# EAGLE design mini-v1.11-macrofab (EAGLE 7.2.0)

## Sheet 1 of 4: Main Microcontroller
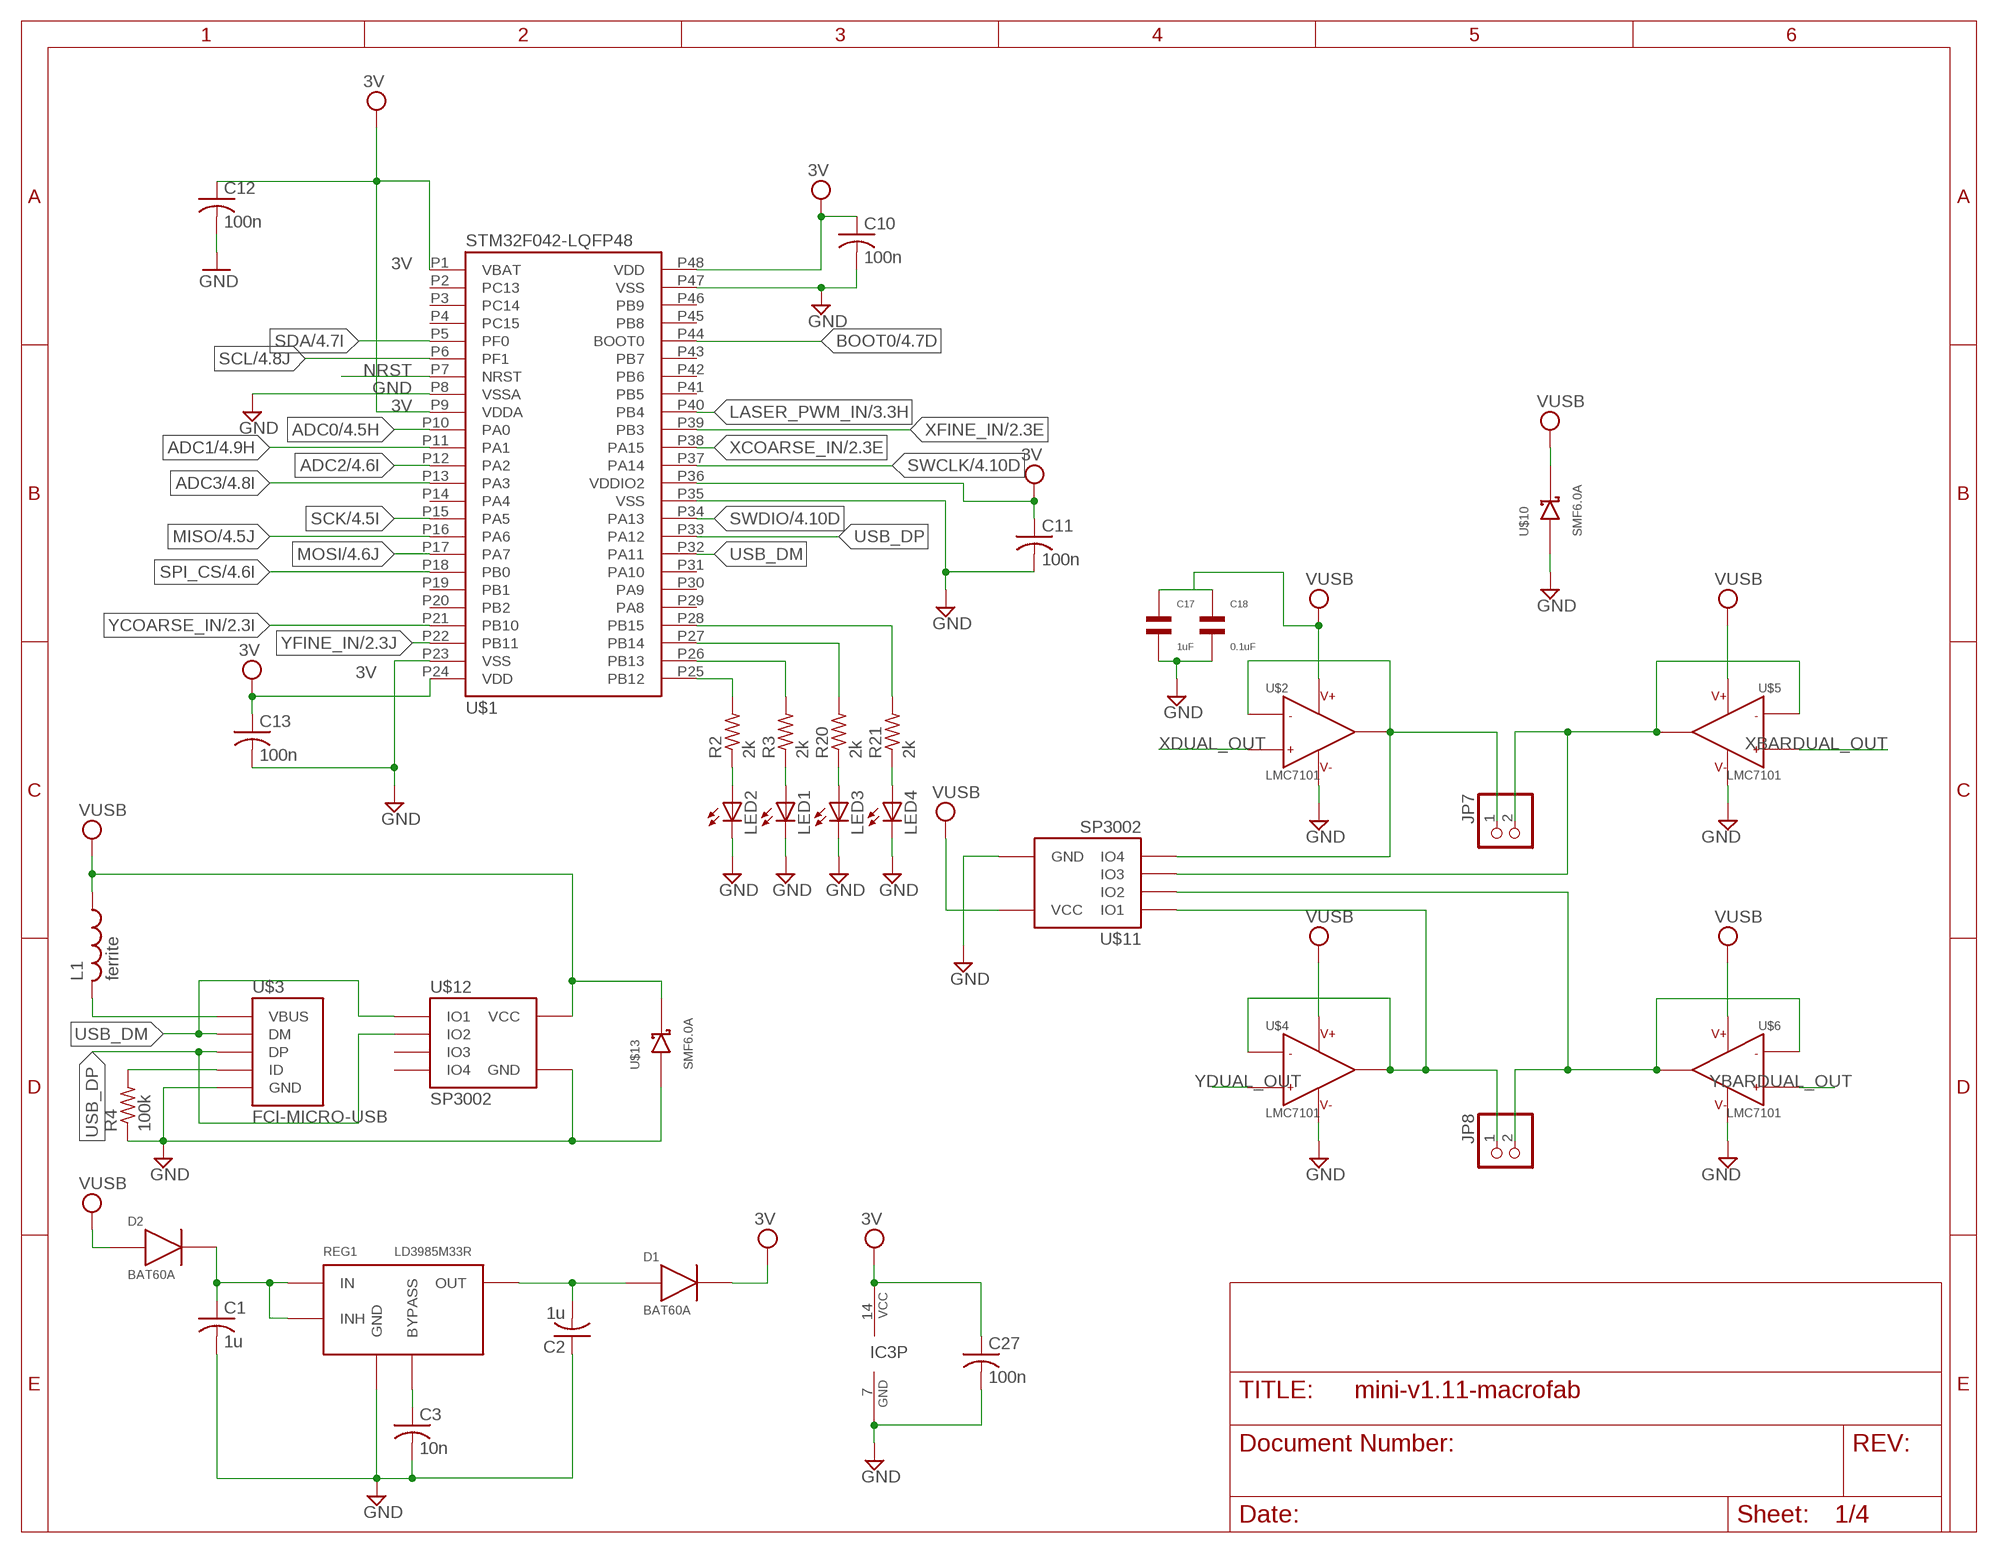
[diagram p0: schematic, sheet 1]

### Parts
C1  1u  C-USC0603  [C0603]
C2  1u  C-USC0603  [C0603]
C3  10n  C-USC0603  [C0603]
C10  100n  C-USC0603  [C0603]
C11  100n  C-USC0603  [C0603]
C12  100n  C-USC0603  [C0603]
C13  100n  C-USC0603  [C0603]
C17  1uF  CAPACITOR_NP_0603  [C0603]
C18  0.1uF  CAPACITOR_NP_0603  [C0603]
C27  100n  C-USC0603  [C0603]
D1  BAT60A  [SOD323]
D2  BAT60A  [SOD323]
IC3  74S04D  [SO14]
JP7  PINHD-1X2  [1X02]
JP8  PINHD-1X2  [1X02]
L1  ferrite  L-US  [C0603]
LED1  LEDCHIP-LED0603  [CHIP-LED0603]
LED2  LEDCHIP-LED0603  [CHIP-LED0603]
LED3  LEDCHIP-LED0603  [CHIP-LED0603]
LED4  LEDCHIP-LED0603  [CHIP-LED0603]
R2  2k  R-US_R0603  [R0603]
R3  2k  R-US_R0603  [R0603]
R4  100k  R-US_R0603  [R0603]
R20  2k  R-US_R0603  [R0603]
R21  2k  R-US_R0603  [R0603]
REG1  LD3985M33R  LD3985MXXR  [SOT23-5L]
U$1  STM32F042-LQFP48  [LQFP48]
U$2  LMC7101  [SOT23-5]
U$3  FCI-MICRO-USB  [FCI-MICROUSB]
U$4  LMC7101  [SOT23-5]
U$5  LMC7101  [SOT23-5]
U$6  LMC7101  [SOT23-5]
U$10  SMF6.0A  MBR0520  [SOD123]
U$11  SP3002  [SC70-6]
U$12  SP3002  [SC70-6]
U$13  SMF6.0A  MBR0520  [SOD123]

### Nets
3V: C10.1 C11.1 C12.1 C13.1 C27.1 D1.1 IC3.14(P:VCC) U$1.P1(VBAT) U$1.P9(VDDA) U$1.P24(VDD) U$1.P36(VDDIO2) U$1.P48(VDD) ; also sheet 2,4
3V3: C2.2 D1.2 REG1.OUT
ADC0: U$1.P10(PA0) ; also sheet 4
ADC1: U$1.P11(PA1) ; also sheet 4
ADC2: U$1.P12(PA2) ; also sheet 4
ADC3: U$1.P13(PA3) ; also sheet 4
BOOT0: U$1.P44(BOOT0) ; also sheet 4
GND [Power]: C1.2 C2.1 C3.2 C10.2 C11.2 C12.2 C13.2 C17.P$2 C18.P$2 C27.2 IC3.7(P:GND) LED1.C LED2.C LED3.C LED4.C R4.1 REG1.GND U$1.P8(VSSA) U$1.P23(VSS) U$1.P35(VSS) U$1.P47(VSS) U$2.5 U$3.P5(GND) U$4.5 U$5.5 U$6.5 U$10.ANODE U$11.P2(GND) U$12.P2(GND) U$13.ANODE ; also sheet 2,3,4
LASER_PWM_IN: U$1.P40(PB4) ; also sheet 3
MISO: U$1.P16(PA6) ; also sheet 4
MOSI: U$1.P17(PA7) ; also sheet 4
N$1: C3.1 REG1.BYPASS
N$2: R2.2 U$1.P25(PB12)
N$3: LED2.A R2.1
N$4: C1.1 D2.1 REG1.IN REG1.INHIBIT(INH)
N$5: R4.2 U$3.P4(ID)
N$7: JP7.1 U$2.1 U$2.4 U$11.P6(IO4)
N$9: JP8.1 U$4.1 U$4.4 U$11.P1(IO1)
N$12: LED1.A R3.1
N$13: R3.2 U$1.P26(PB13)
N$14: L1.2 U$3.P1(VBUS)
N$16: JP7.2 U$5.1 U$5.4 U$11.P4(IO3)
N$17: JP8.2 U$6.1 U$6.4 U$11.P3(IO2)
N$24: LED3.A R20.1
N$27: LED4.A R21.1
N$28: R20.2 U$1.P27(PB14)
N$29: R21.2 U$1.P28(PB15)
NRST: U$1.P7(NRST) ; also sheet 4
SCK: U$1.P15(PA5) ; also sheet 4
SCL: U$1.P6(PF1) ; also sheet 4
SDA: U$1.P5(PF0) ; also sheet 4
SPI_CS: U$1.P18(PB0) ; also sheet 4
SWCLK: U$1.P37(PA14) ; also sheet 4
SWDIO: U$1.P34(PA13) ; also sheet 4
USB_DM: U$1.P32(PA11) U$3.P2(DM) U$12.P1(IO1)
USB_DP: U$1.P33(PA12) U$3.P3(DP) U$12.P3(IO2)
VUSB [Power]: C17.P$1 C18.P$1 D2.2 L1.1 U$2.2 U$4.2 U$5.2 U$6.2 U$10.CATHODE U$11.P5(VCC) U$12.P5(VCC) U$13.CATHODE ; also sheet 2,3,4
XBARDUAL_OUT: U$5.3 ; also sheet 2
XCOARSE_IN: U$1.P38(PA15) ; also sheet 2
XDUAL_OUT: U$2.3 ; also sheet 2
XFINE_IN: U$1.P39(PB3) ; also sheet 2
YBARDUAL_OUT: U$6.3 ; also sheet 2
YCOARSE_IN: U$1.P21(PB10) ; also sheet 2
YDUAL_OUT: U$4.3 ; also sheet 2
YFINE_IN: U$1.P22(PB11) ; also sheet 2
Unconnected: U$1.P2(PC13) U$1.P3(PC14) U$1.P4(PC15) U$1.P14(PA4) U$1.P19(PB1) U$1.P20(PB2) U$1.P29(PA8) U$1.P30(PA9) U$1.P31(PA10) U$1.P41(PB5) U$1.P42(PB6) U$1.P43(PB7) U$1.P45(PB8) U$1.P46(PB9) U$12.P4(IO3) U$12.P6(IO4)

## Sheet 2 of 4: Dual PWM
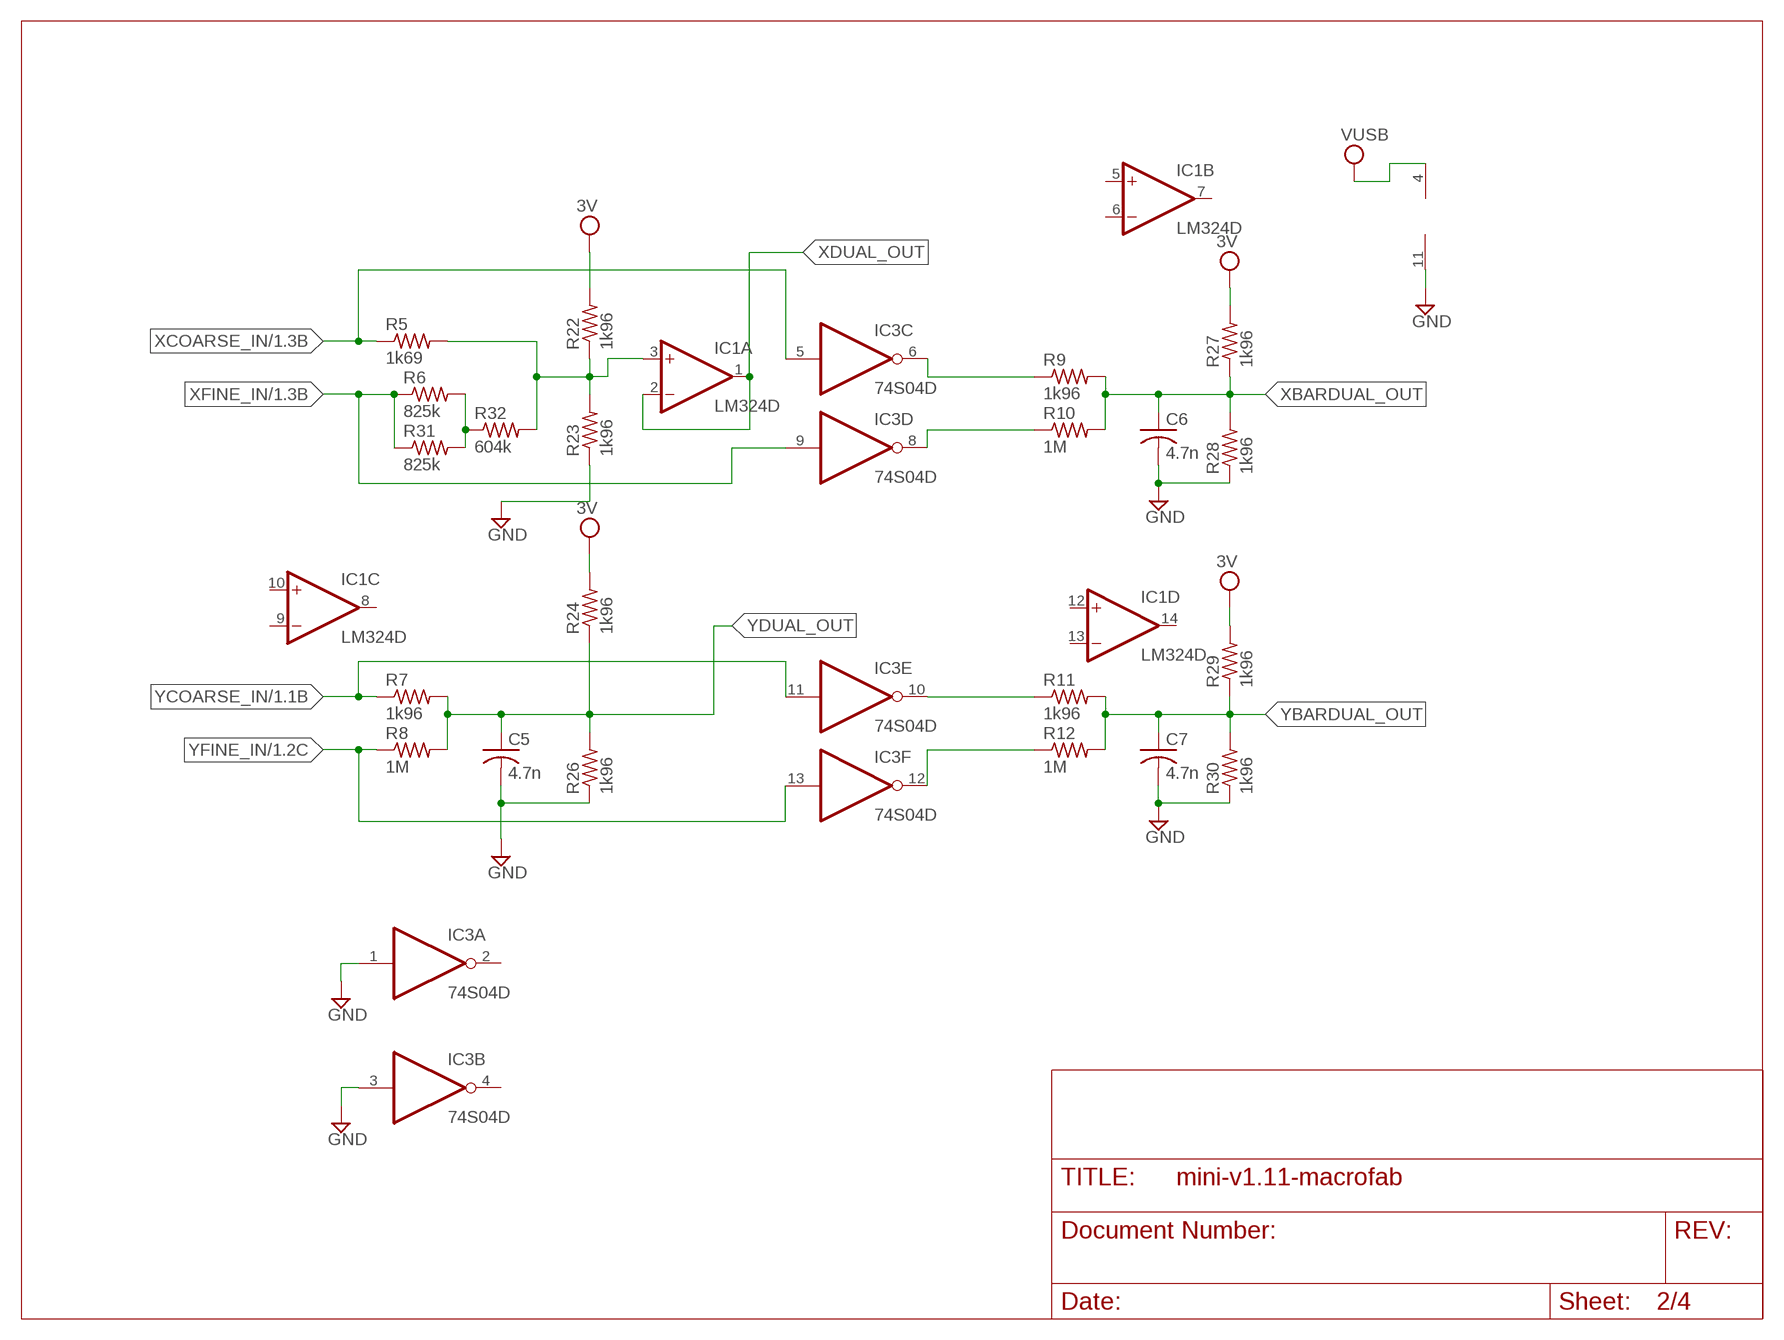
[diagram p1: schematic, sheet 2]

### Parts
C5  4.7n  C-USC0603  [C0603]
C6  4.7n  C-USC0603  [C0603]
C7  4.7n  C-USC0603  [C0603]
IC1  LM324D  [SO14]
R5  1k69  R-US_R0603  [R0603]
R6  825k  R-US_R0603  [R0603]
R7  1k96  R-US_R0603  [R0603]
R8  1M  R-US_R0603  [R0603]
R9  1k96  R-US_R0603  [R0603]
R10  1M  R-US_R0603  [R0603]
R11  1k96  R-US_R0603  [R0603]
R12  1M  R-US_R0603  [R0603]
R22  1k96  R-US_R0603  [R0603]
R23  1k96  R-US_R0603  [R0603]
R24  1k96  R-US_R0603  [R0603]
R26  1k96  R-US_R0603  [R0603]
R27  1k96  R-US_R0603  [R0603]
R28  1k96  R-US_R0603  [R0603]
R29  1k96  R-US_R0603  [R0603]
R30  1k96  R-US_R0603  [R0603]
R31  825k  R-US_R0603  [R0603]
R32  604k  R-US_R0603  [R0603]

### Nets
3V: R22.2 R24.2 R27.2 R29.2 ; also sheet 1,4
GND [Power]: C5.2 C6.2 C7.2 IC1.11(P:V-) IC3.1(A:I) IC3.3(B:I) R23.1 R26.1 R28.1 R30.1 ; also sheet 1,3,4
N$6: IC3.10(E:O) R11.1
N$8: IC3.12(F:O) R12.1
N$10: IC3.8(D:O) R10.1
N$11: IC3.6(C:O) R9.1
N$31: R6.2 R31.2 R32.1
N$33: IC1.3(A:+IN) R5.2 R22.1 R23.2 R32.2
VUSB [Power]: IC1.4(P:V+) ; also sheet 1,3,4
XBARDUAL_OUT: C6.1 R9.2 R10.2 R27.1 R28.2 ; also sheet 1
XCOARSE_IN: IC3.5(C:I) R5.1 ; also sheet 1
XDUAL_OUT: IC1.1(A:OUT) IC1.2(A:-IN) ; also sheet 1
XFINE_IN: IC3.9(D:I) R6.1 R31.1 ; also sheet 1
YBARDUAL_OUT: C7.1 R11.2 R12.2 R29.1 R30.2 ; also sheet 1
YCOARSE_IN: IC3.11(E:I) R7.1 ; also sheet 1
YDUAL_OUT: C5.1 R7.2 R8.2 R24.1 R26.2 ; also sheet 1
YFINE_IN: IC3.13(F:I) R8.1 ; also sheet 1
Unconnected: IC1.5(B:+IN) IC1.6(B:-IN) IC1.7(B:OUT) IC1.8(C:OUT) IC1.9(C:-IN) IC1.10(C:+IN) IC1.12(D:+IN) IC1.13(D:-IN) IC1.14(D:OUT) IC3.2(A:O) IC3.4(B:O)

## Sheet 3 of 4: Laser Power Driver
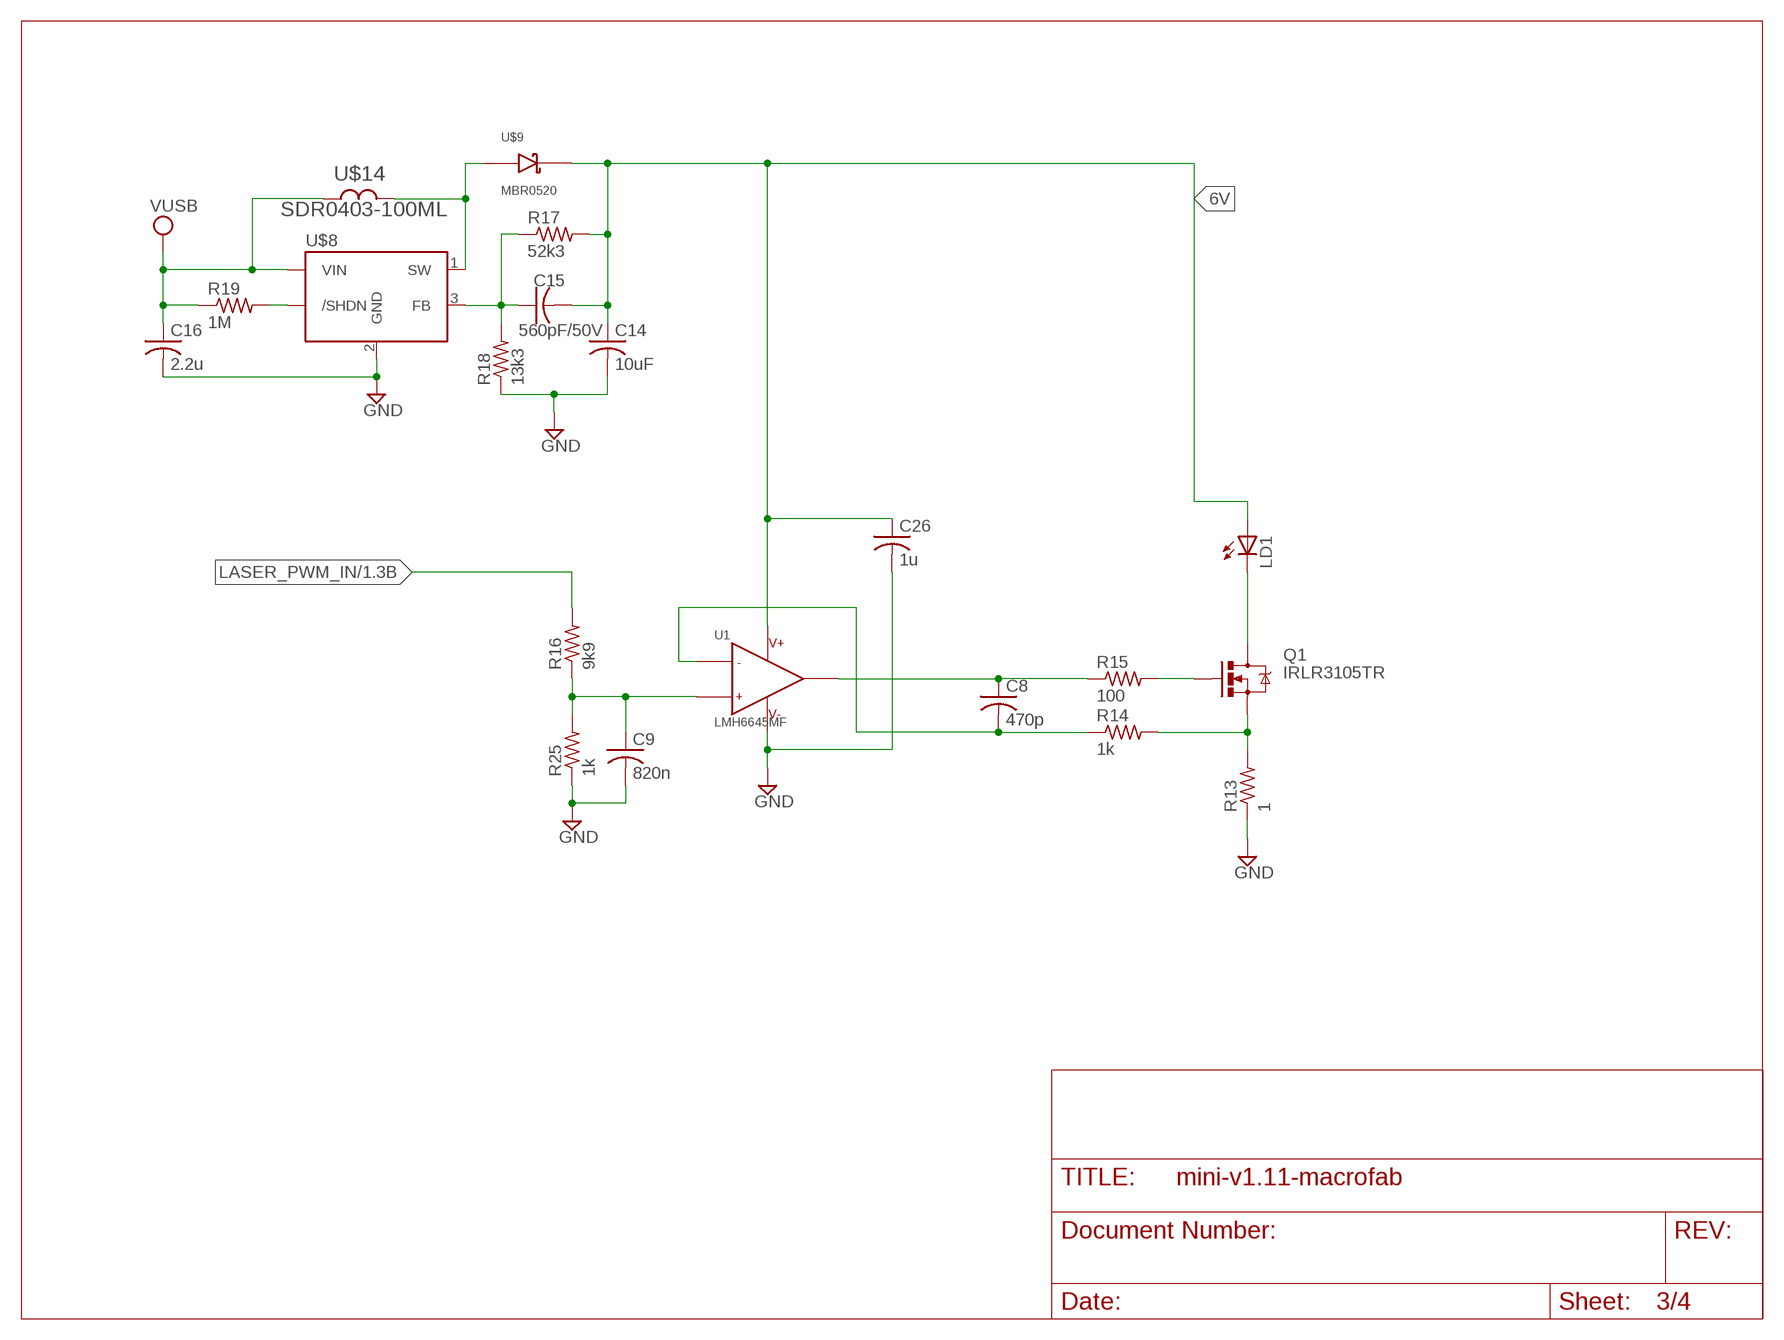
[diagram p2: schematic, sheet 3]

### Parts
C8  470p  C-USC0603  [C0603]
C9  820n  C-USC0603  [C0603]
C14  10uF  C-USC0603  [C0603]
C15  560pF/50V  C-USC0603  [C0603]
C16  2.2u  C-USC0603  [C0603]
C26  1u  C-USC0603  [C0603]
LD1  LASERDIODELD2  [LASERDIODE2]
Q1  IRLR3105TR  FET-N-IRLR3105TRIRLR3105TR  [DPAK]
R13  1  R-US_R0603  [R0603]
R14  1k  R-US_R0603  [R0603]
R15  100  R-US_R0603  [R0603]
R16  9k9  R-US_R0603  [R0603]
R17  52k3  R-US_R0603  [R0603]
R18  13k3  R-US_R0603  [R0603]
R19  1M  R-US_R0603  [R0603]
R25  1k  R-US_R0603  [R0603]
U1  LMH6645MF  OPAMP-SINGLELMH6645MF  [SOT23-5]
U$8  LMR62014  [SOT23-5]
U$9  MBR0520  [SOD123]
U$14  SDR0403-100ML  SDR0403  [SDR0403]

### Nets
6V [Power]: C14.1 C15.2 C26.1 LD1.P$1(A) R17.2 U1.5(V+) U$9.CATHODE
GND [Power]: C9.2 C14.2 C16.2 C26.2 R13.1 R18.1 R25.1 U1.2(V-) U$8.2(GND) ; also sheet 1,2,4
LASER_PWM_IN: R16.2 ; also sheet 1
N$15: U$8.1(SW) U$9.ANODE U$14.P$2
N$18: LD1.P$3(C) Q1.4(D)
N$19: Q1.3(S) R13.2 R14.2
N$20: C8.2 R14.1 U1.4(IN-)
N$21: Q1.1(G) R15.2
N$22: C8.1 R15.1 U1.1(OUT)
N$23: C9.1 R16.1 R25.2 U1.3(IN+)
N$25: C15.1 R17.1 R18.2 U$8.3(FB)
N$26: R19.2 U$8.4(/SHDN)
VUSB [Power]: C16.1 R19.1 U$8.5(VIN) U$14.P$1 ; also sheet 1,2,4

## Sheet 4 of 4
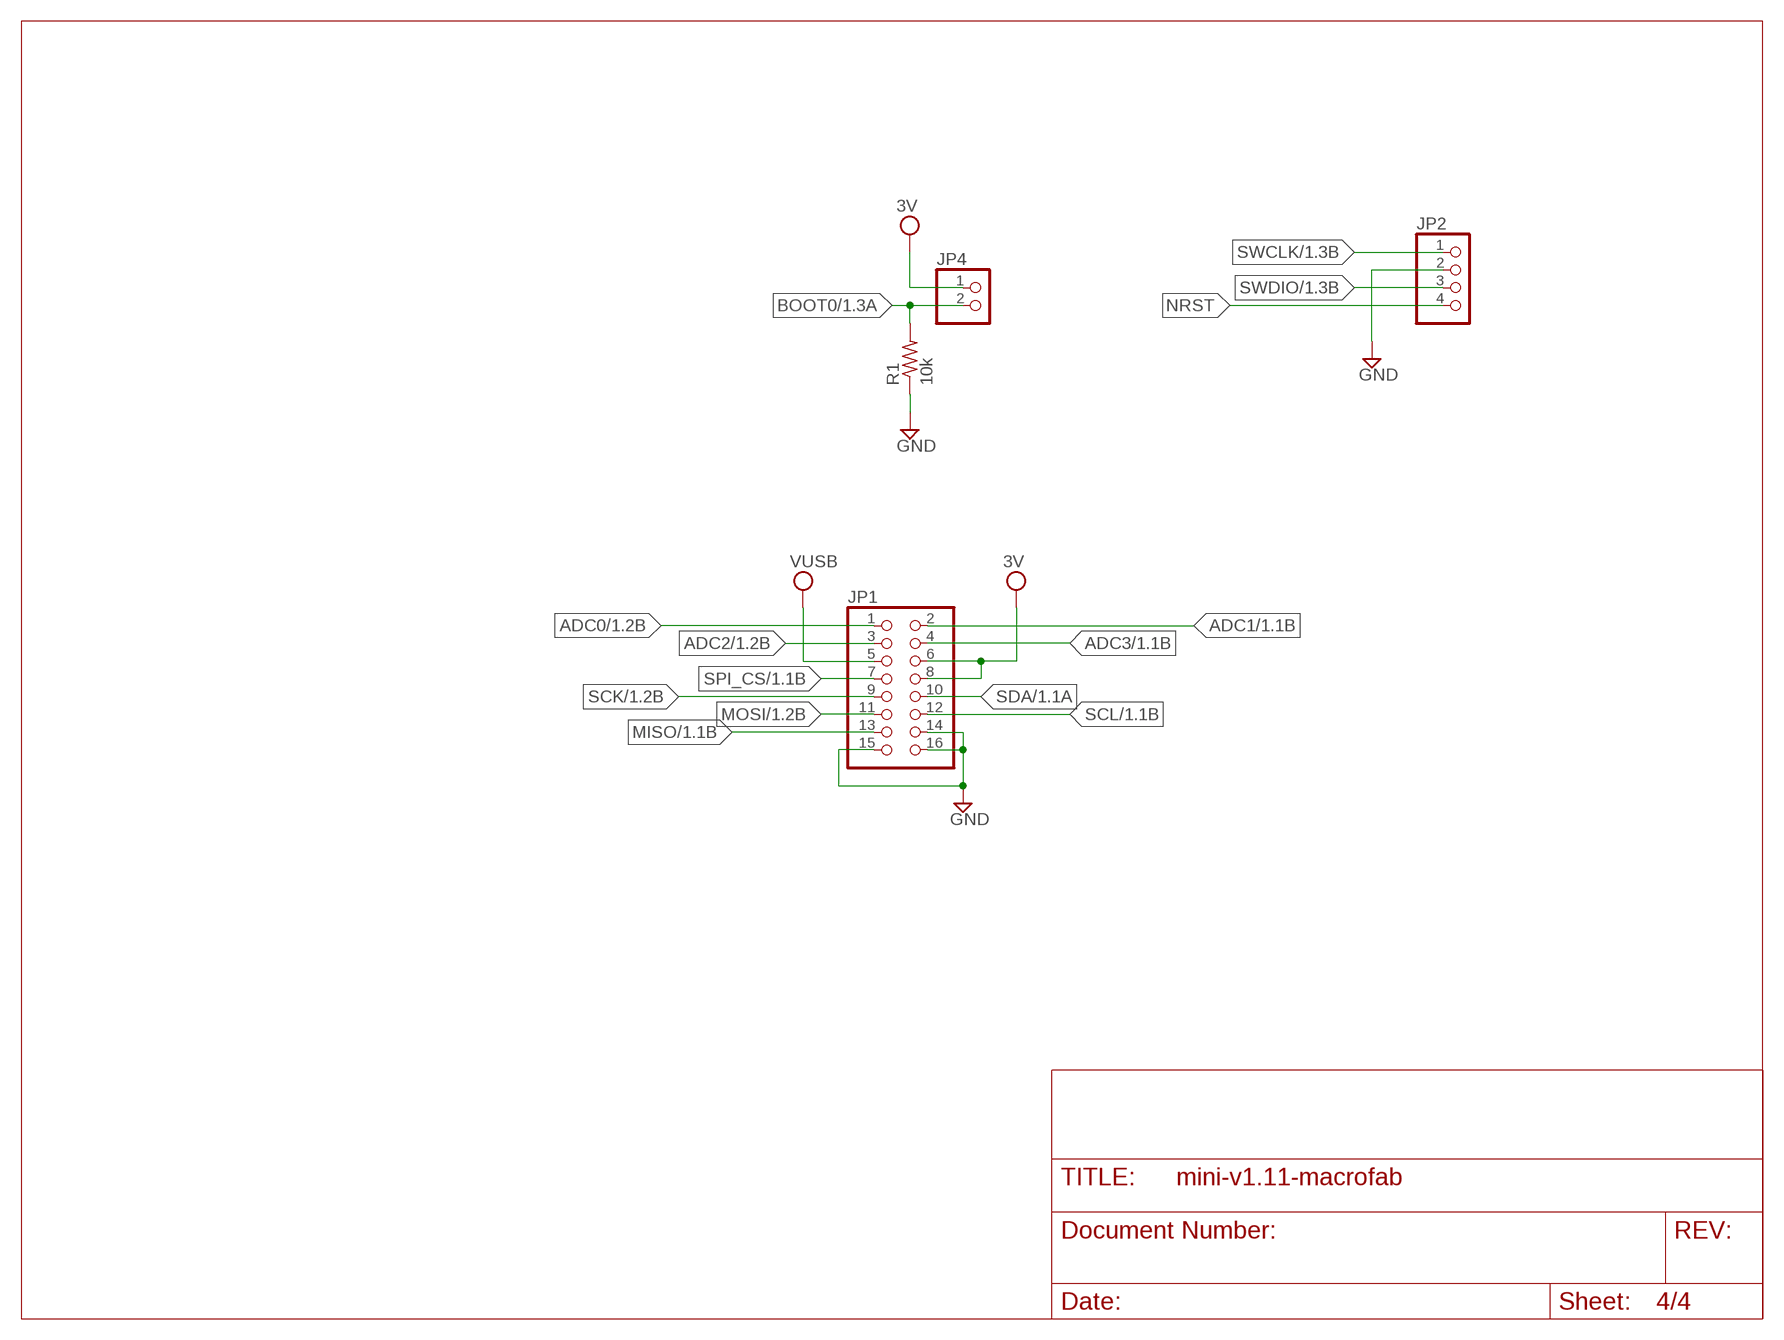
[diagram p3: schematic, sheet 4]

### Parts
JP1  PINHD-2X8  [2X08]
JP2  PINHD-1X4  [1X04]
JP4  PINHD-1X2  [1X02]
R1  10k  R-US_R0603  [R0603]

### Nets
3V: JP1.6 JP1.8 JP4.1 ; also sheet 1,2
ADC0: JP1.1 ; also sheet 1
ADC1: JP1.2 ; also sheet 1
ADC2: JP1.3 ; also sheet 1
ADC3: JP1.4 ; also sheet 1
BOOT0: JP4.2 R1.2 ; also sheet 1
GND [Power]: JP1.14 JP1.15 JP1.16 JP2.2 R1.1 ; also sheet 1,2,3
MISO: JP1.13 ; also sheet 1
MOSI: JP1.11 ; also sheet 1
NRST: JP2.4 ; also sheet 1
SCK: JP1.9 ; also sheet 1
SCL: JP1.12 ; also sheet 1
SDA: JP1.10 ; also sheet 1
SPI_CS: JP1.7 ; also sheet 1
SWCLK: JP2.1 ; also sheet 1
SWDIO: JP2.3 ; also sheet 1
VUSB [Power]: JP1.5 ; also sheet 1,2,3

## Library data of the parts
C1-C3 C5-C16 C26 C27 = rcl:C-US: CAPACITOR, American symbol
C17 C18 = MF_Passives:CAPACITOR_NP: Library: MF_Passives Description: Device for Non-Polarized Capacitors. Manufacture part number (MFG#), Voltage, Temperature Coefficient, and Tolerance can be added via Attributes.; MFG#: N/A; TEMP_COF: N/A; TOLERANCE: N/A; VOLTAGE: N/A
D1 D2 = lmdparts:BAT60A
IC1 = linear:LM324: OP AMP
IC3 = lmdparts:74*04: Hex INVERTER
JP1 = pinhead:PINHD-2X8: PIN HEADER
JP2 = pinhead:PINHD-1X4: PIN HEADER
JP4 JP7 JP8 = pinhead:PINHD-1X2: PIN HEADER
L1 = lmdparts:L-US: INDUCTOR, American symbol
LD1 = Scott:LASERDIODE; MPN: 3 x (0552-2-15-15-11-27-10-0)
LED1-LED4 = adafruit:LED: LED OSRAM: - CHIPLED LG R971, LG N971, LY N971, LG Q971, LY Q971, LO R971, LY R971 LH N974, LH R974 LS Q976, LO Q976, LY Q976 LO Q996 - Hyper CHIPLED LW Q18S LB Q993, LB Q99A, LB R99A - SideLED LS A670, LO A670, LY A670, LG A670, LP A670 LB A673, LV A673, LT A673, LW A673 LH A674 LY A675 LS A676, LA A676, LO A676, LY A676, LW A676 LS A679, LY A679, LG A679 - Hyper Micro SIDELED® LS Y876, LA Y876, LO Y876, LY Y876 LT Y87S - SmartLED LW L88C, LW L88S LB L89C, LB L89S, LG L890 LS L89K, LO L89K, LY L89K LS L896, LA L896, LO L896, LY L896 - TOPLED LS T670, LO T670, LY T670, LG T670, LP T670 LSG T670, LSP T670, LSY T670, LOP T670, LYG T670 LG T671, LOG T671, LSG T671 LB T673, LV T673, LT T673, LW T673 LH T674 LS T676, LA T676, LO T676, LY T676, LB T676, LH T676, LSB T676, LW T676 LB T67C, LV T67C, LT T67C, LS T67K, LO T67K, LY T67K, LW E67C LS E67B, LA E67B, LO E67B, LY E67B, LB E67C, LV E67C, LT E67C LW T67C LS T679, LY T679, LG T679 LS T770, LO T770, LY T770, LG T770, LP T770 LB T773, LV T773, LT T773, LW T773 LH T774 LS E675, LA E675, LY E675, LS T675 LS T776, LA T776, LO T776, LY T776, LB T776 LHGB T686 LT T68C, LB T68C - Hyper Mini TOPLED® LB M676 - Mini TOPLED Santana® LG M470 LS M47K, LO M47K, LY M47K Source: http://www.osram.convergy.de/
Q1 = lmdparts:FET-N-IRLR3105TR: Common NMOSFET Parts MFG P/N Store ID Prod ID FDD8780 TRANS-09984 SI7820DN TRANS-11055 FDS6630A IC-08089 2N7002PW TRANS-11151 FQP30N06L COM-10213 TRANS-10060 BSS123LT1G TRANS-08345 BSS138 TRANS-00830 BS170 2N7000; PROD_ID: TRANS-09984
R1-R32 = rcl:R-US_: RESISTOR, American symbol
REG1 = lmdparts:LD3985MXXR
U1 = lmdparts:OPAMP-SINGLE: Single amp opamps
U$1 = lmdparts:STM32F042-LQFP48
U$2 U$4-U$6 = lmdparts:LMC7101
U$3 = lmdparts:FCI-MICRO-USB
U$8 = lmdparts:LMR62014
U$9 U$10 U$13 = lmdparts:MBR0520
U$11 U$12 = lmdparts:SP3002
U$14 = lmdparts:SDR0403

## Net classes
1 Power: width 0.305 mm

## Board
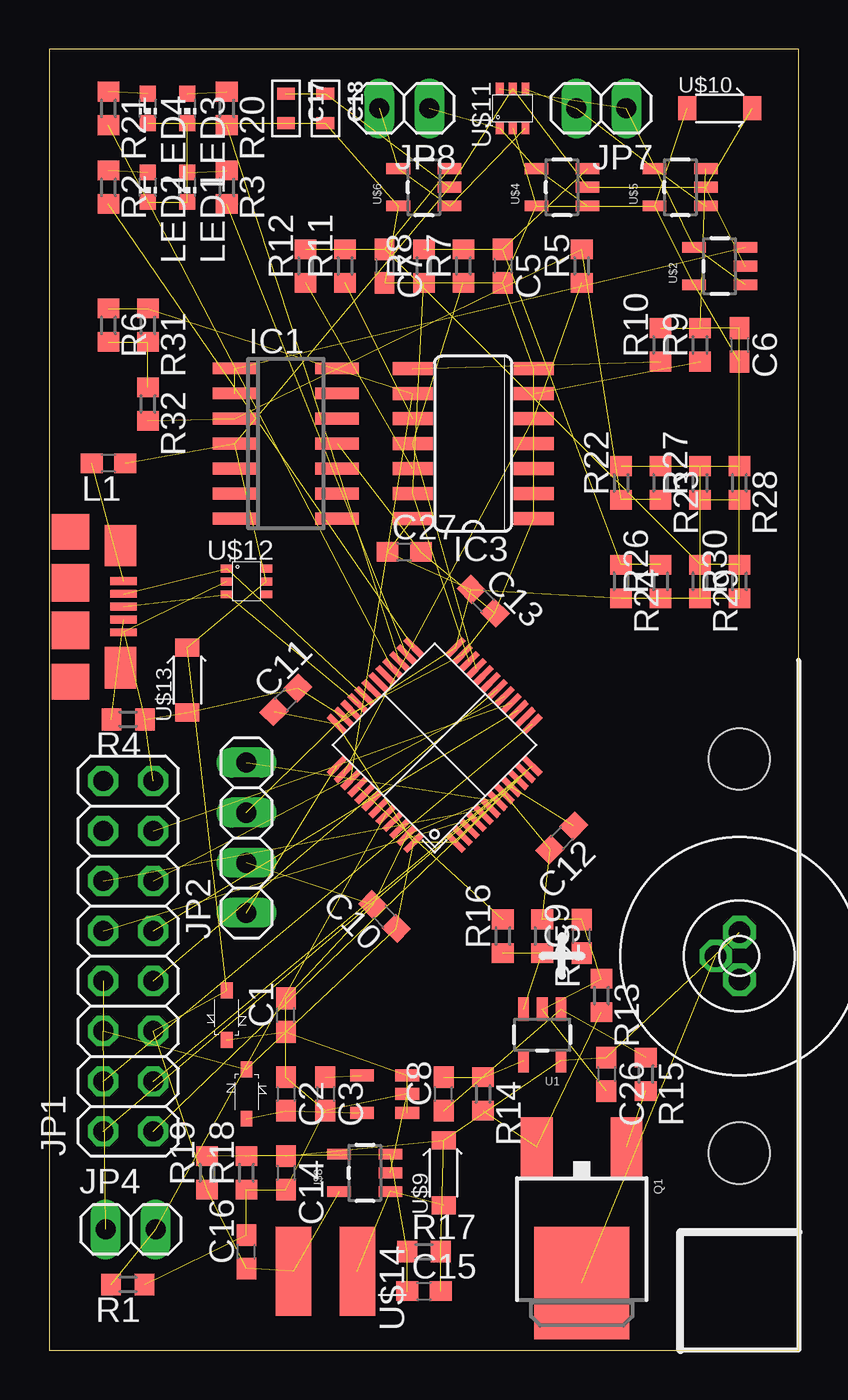
[diagram p4: board, top side]
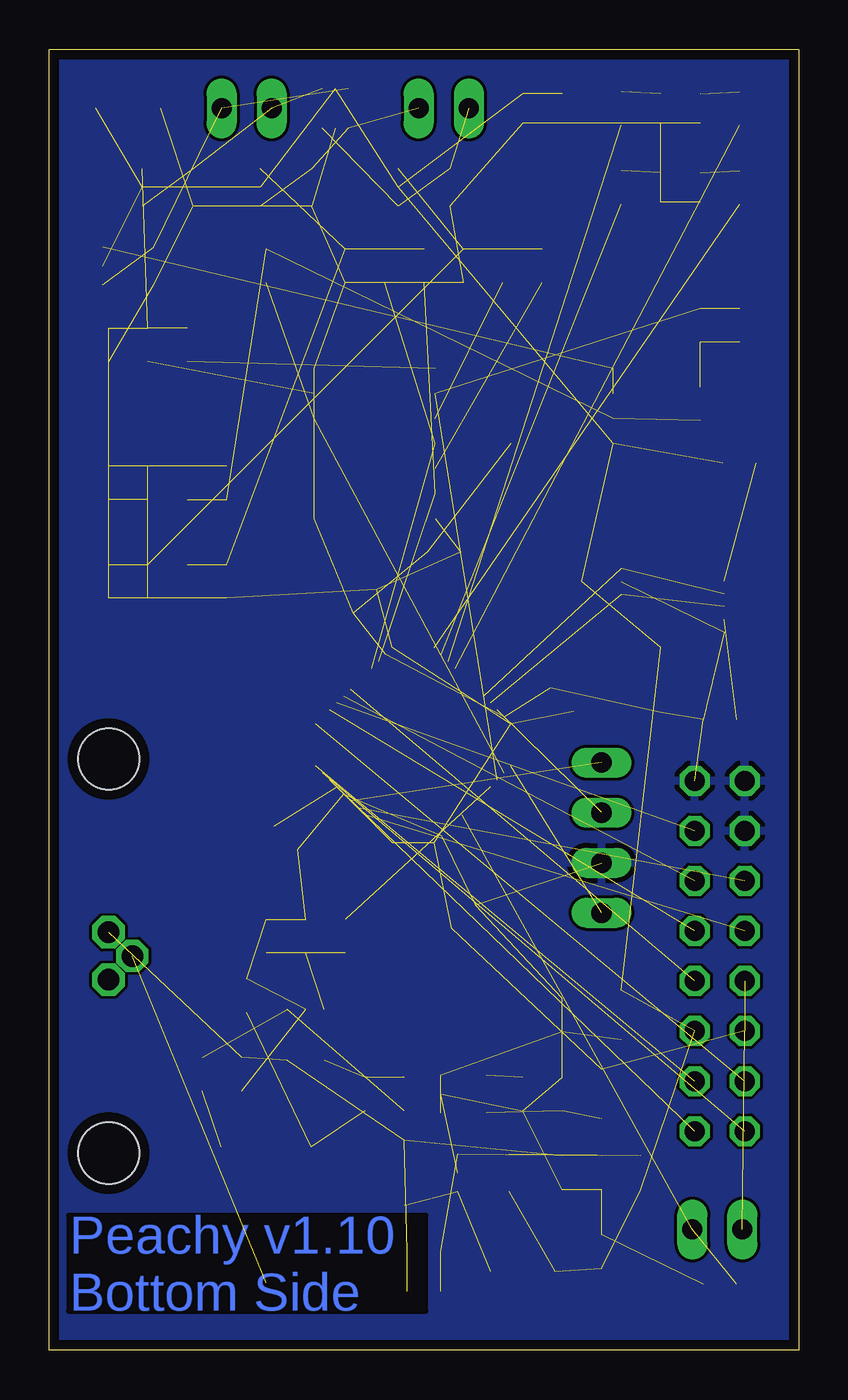
[diagram p5: board, bottom side, seen from below]

Size 38.01 x 66 mm. Coordinates in mm from the lower left corner, seen from the top.
Outline: 0,0 38.01,0 38,66 0,66 0,0
Copper layers (1*16): Top 0.035mm / dielectric 1.5mm / Bottom 0.035mm
Design rules "SeeedStudio_2layer_DRU_no_angle_20140221 *": minimum track width 6mil, minimum drill 12mil, track to track 6mil, track to pad 6mil, pad to pad 6mil, via to via 6mil, smd to smd 0mil, copper to edge 20mil, drill to drill 10mil, minimum pad ring 10mil, minimum via ring 6mil, stop-mask expansion 2mil, vias tented up to drill 100mil, thermal gap 10mil
Holes 3.1 mm at 35,10 35,30

### Footprints (pad centres in the part's own frame; a part is rotated, then mirrored left to right if it is on the bottom)
C0603 = smd 1.1 x 1: 1 -0.85,0; 2 0.85,0
C0603' = smd 0.6 x 0.9: P$1 -0.75,0; P$2 0.75,0
SOD323 = smd 0.6 x 0.8: 1 0,1.25; 2 0,-1.25
SO14 = smd 0.6 x 2.2: 1 -3.81,-2.6; 2 -2.54,-2.6; 3 -1.27,-2.6; 4 0,-2.6; 5 1.27,-2.6; 6 2.54,-2.6; 7 3.81,-2.6; 8 3.81,2.6; 9 2.54,2.6; 10 1.27,2.6; 11 0,2.6; 12 -1.27,2.6; 13 -2.54,2.6; 14 -3.81,2.6
SO14' = smd 0.66 x 2.032: 1 -3.81,-3.073; 2 -2.54,-3.073; 3 -1.27,-3.073; 4 0,-3.073; 5 1.27,-3.073; 6 2.54,-3.073; 7 3.81,-3.073; 8 3.81,3.073; 9 2.54,3.073; 10 1.27,3.073; 11 0,3.073; 12 -1.27,3.073; 13 -2.54,3.073; 14 -3.81,3.073
2X08 = drill 1.016 octagon: 1 -8.89,-1.27; 2 -8.89,1.27; 3 -6.35,-1.27; 4 -6.35,1.27; 5 -3.81,-1.27; 6 -3.81,1.27; 7 -1.27,-1.27; 8 -1.27,1.27; 9 1.27,-1.27; 10 1.27,1.27; 11 3.81,-1.27; 12 3.81,1.27; 13 6.35,-1.27; 14 6.35,1.27; 15 8.89,-1.27; 16 8.89,1.27
1X04 = drill 1.016 long: 1 -3.81,0; 2 -1.27,0; 3 1.27,0; 4 3.81,0
1X02 = drill 1.016 long: 1 -1.27,0; 2 1.27,0
LASERDIODE2 = drill 1.092 pad 1.499 octagon: P$1 0,1.203; P$2 0,-1.203; P$3 -1.203,0
CHIP-LED0603 = smd 0.8 x 0.8: A 0,-0.75; C 0,0.75
DPAK = smd 1.6 x 3: 1 -2.28,-5.31; 3 2.28,-5.31 | smd 4.826 x 5.715: 4 0,1.588
R0603 = smd 1 x 1.1: 1 -0.85,0; 2 0.85,0
SOT23-5L = smd 0.6 x 1.2: BYPASS -0.95,-1.15; GND 0,1.15; IN 0.95,1.15; INHIBIT -0.95,1.15; OUT 0.95,-1.15
SOT23-5 = smd 0.55 x 1.2: 1 -0.95,-1.3; 2 0,-1.3; 3 0.95,-1.3; 4 0.95,1.3; 5 -0.95,1.3
LQFP48 = smd 0.3 x 1.2: P1 -2.75,-0.6; P2 -2.25,-0.6; P3 -1.75,-0.6; P4 -1.25,-0.6; P5 -0.75,-0.6; P6 -0.25,-0.6; P7 0.25,-0.6; P8 0.75,-0.6; P9 1.25,-0.6; P10 1.75,-0.6; P11 2.25,-0.6; P12 2.75,-0.6; P25 2.75,7.9; P26 2.25,7.9; P27 1.75,7.9; P28 1.25,7.9; P29 0.75,7.9; P30 0.25,7.9; P31 -0.25,7.9; P32 -0.75,7.9; P33 -1.25,7.9; P34 -1.75,7.9; P35 -2.25,7.9; P36 -2.75,7.9 | smd 1.2 x 0.3: P13 4.25,0.9; P14 4.25,1.4; P15 4.25,1.9; P16 4.25,2.4; P17 4.25,2.9; P18 4.25,3.4; P19 4.25,3.9; P20 4.25,4.4; P21 4.25,4.9; P22 4.25,5.4; P23 4.25,5.9; P24 4.25,6.4; P37 -4.25,6.4; P38 -4.25,5.9; P39 -4.25,5.4; P40 -4.25,4.9; P41 -4.25,4.4; P42 -4.25,3.9; P43 -4.25,3.4; P44 -4.25,2.9; P45 -4.25,2.4; P46 -4.25,1.9; P47 -4.25,1.4; P48 -4.25,0.9
FCI-MICROUSB = smd 0.4 x 1.35: P1 -1.3,2.7; P2 -0.65,2.7; P3 0,2.7; P4 0.65,2.7; P5 1.3,2.7 | smd 1.8 x 1.9: P$1 3.8,0; P$2 -3.8,0 | smd 1.9 x 1.9: P$3 -1.2,0; P$4 1.2,0 | smd 2.1 x 1.6: P$5 -3.1,2.55; P$6 3.1,2.55
SOD123 = smd 0.91 x 1.22: ANODE -1.65,0; CATHODE 1.65,0
SC70-6 = smd 0.4 x 0.6: P1 -0.65,-1; P2 0,-1; P3 0.65,-1; P4 0.65,1; P5 0,1; P6 -0.65,1
SDR0403 = smd 4.5 x 1.8: P$1 0,1.625; P$2 0,-1.625

### Placement (x,y rotation side)
C1  12,17 90 top
C2  12,13 270 top
C3  14,13 270 top
C5  23,55 270 top
C6  35,51 270 top
C7  17,55 270 top
C8  20,13 90 top
C9  27,21 90 top
C10  17,22 135 top
C11  12,33 45 top
C12  26,26 225 top
C13  22,38 315 top
C14  12,9 270 top
C15  19,3 0 top
C16  10,5 90 top
C17  1uF  [C0603']  12,63 270 top
C18  0.1uF  [C0603']  14,63 270 top
C26  28.25,14 270 top
C27  18,40.5 0 top
D1  10,13 0 top
D2  9,17 180 top
IC1  12,46 270 top
IC3  74S04D  [SO14']  21.5,46 90 top
JP1  4,20 90 top
JP2  10,26 90 top
JP4  4.12,6.12 0 top
JP7  28,63 180 top
JP8  18,63 180 top
L1  3,45 180 top
LD1  35,20 0 top
LED1  7,59 180 top
LED2  5,59 180 top
LED3  7,63 180 top
LED4  5,63 180 top
Q1  27,5 180 top
R1  3.98,3.34 180 top
R2  3,59 270 top
R3  9,59 270 top
R4  4,32 180 top
R5  27,55 90 top
R6  3,52 270 top
R7  21,55 90 top
R8  19,55 90 top
R9  33,51 90 top
R10  31,51 90 top
R11  15,55 90 top
R12  13,55 90 top
R13  28,18 270 top
R14  22,13 270 top
R15  30.25,14 270 top
R16  23,21 90 top
R17  19,5 0 top
R18  10,9 90 top
R19  8,9 90 top
R20  9,63 270 top
R21  3,63 270 top
R22  29,44 90 top
R23  31,44 270 top
R24  29,39 270 top
R25  25,21 270 top
R26  31,39 90 top
R27  33,44 90 top
R28  35,44 270 top
R29  33,39 270 top
R30  35,39 90 top
R31  5,52 270 top
R32  5,48 270 top
REG1  17,13 270 top
U1  25,16 180 top
U$1  22.12,28.12 45 top
U$2  34,55 90 top
U$3  1.07,37.73 270 top
U$4  26,59 90 top
U$5  32,59 90 top
U$6  19,59 90 top
U$8  16,9 90 top
U$9  20,9 90 top
U$10  34,63 0 top
U$11  23.5,63 0 top
U$12  10,39 270 top
U$13  7,34 90 top
U$14  14,4 90 top

### Tracks (layer width: path | path; a pad name or v marks a point on that pad's centre or on a via)
3V  (18 unrouted)
3V3  (2 unrouted)
6V  (6 unrouted)
ADC0  (1 unrouted)
ADC1  (1 unrouted)
ADC2  (1 unrouted)
ADC3  (1 unrouted)
BOOT0  (2 unrouted)
GND  (50 unrouted)
  pour Bottom: 0,0 38,0 38,66 0,66
LASER_PWM_IN  (1 unrouted)
MISO  (1 unrouted)
MOSI  (1 unrouted)
N$1  (1 unrouted)
N$2  (1 unrouted)
N$3  (1 unrouted)
N$4  (3 unrouted)
N$5  (1 unrouted)
N$6  (1 unrouted)
N$7  (3 unrouted)
N$8  (1 unrouted)
N$9  (3 unrouted)
N$10  (1 unrouted)
N$11  (1 unrouted)
N$12  (1 unrouted)
N$13  (1 unrouted)
N$14  (1 unrouted)
N$15  (2 unrouted)
N$16  (3 unrouted)
N$17  (3 unrouted)
N$18  (1 unrouted)
N$19  (2 unrouted)
N$20  (2 unrouted)
N$21  (1 unrouted)
N$22  (2 unrouted)
N$23  (3 unrouted)
N$24  (1 unrouted)
N$25  (3 unrouted)
N$26  (1 unrouted)
N$27  (1 unrouted)
N$28  (1 unrouted)
N$29  (1 unrouted)
N$31  (2 unrouted)
N$33  (4 unrouted)
NRST  (1 unrouted)
SCK  (1 unrouted)
SCL  (1 unrouted)
SDA  (1 unrouted)
SPI_CS  (1 unrouted)
SWCLK  (1 unrouted)
SWDIO  (1 unrouted)
USB_DM  (2 unrouted)
USB_DP  (2 unrouted)
VUSB  (17 unrouted)
XBARDUAL_OUT  (5 unrouted)
XCOARSE_IN  (2 unrouted)
XDUAL_OUT  (2 unrouted)
XFINE_IN  (3 unrouted)
YBARDUAL_OUT  (5 unrouted)
YCOARSE_IN  (2 unrouted)
YDUAL_OUT  (5 unrouted)
YFINE_IN  (2 unrouted)

### Text on the board
Bottom: Peachy v1.10 / Bottom Side